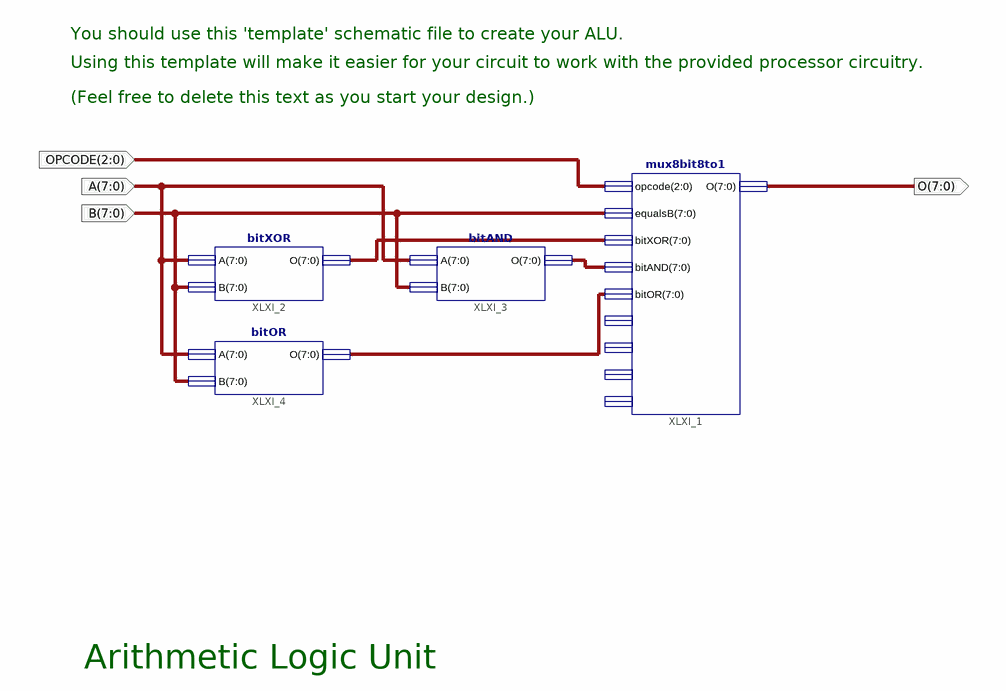
[diagram p0: schematic sheet 1]
// Xilinx ISE schematic ALU.sch (spartan6) as structural Verilog: 4 symbols, 4 ports
module ALU (
  input  [2:0] OPCODE,
  input  [7:0] A,
  input  [7:0] B,
  output [7:0] O
);

  wire [7:0] XLXN_18, XLXN_19, XLXN_22;

  mux8bit8to1 XLXI_1 (
    .opcode(OPCODE), .equalsB(B), .bitXOR(XLXN_18), .bitAND(XLXN_19), .bitOR(XLXN_22), .O(O));  // open: multiply, shiftRight, subtract, add
  bitXOR XLXI_2 (.A(A), .B(B), .O(XLXN_18));
  bitAND XLXI_3 (.A(A), .B(B), .O(XLXN_19));
  bitOR XLXI_4 (.A(A), .B(B), .O(XLXN_22));

  // Notes on the sheet:
  //   You should use this 'template' schematic file to create your ALU.
  //   Using this template will make it easier for your circuit to work with the provided processor circuitry.
  //   (Feel free to delete this text as you start your design.)
  //   Arithmetic Logic Unit
endmodule
